# Altium schematic sheet WaterLevelControl-v1.0_top.SchDoc
size A4; SheetNumber: 1; SheetTotal: 5
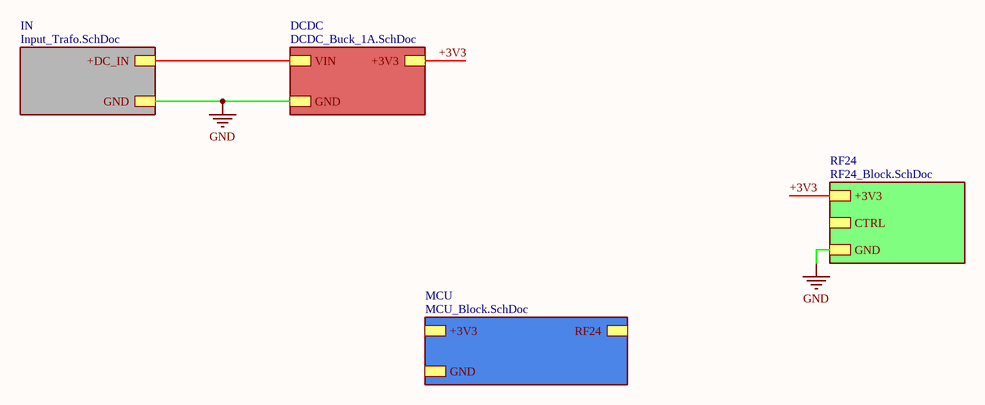
[diagram p0: WaterLevelControl-v1.0_top.SchDoc]

## Sub-sheets
DCDC = DCDC_Buck_1A.SchDoc: GND, VIN, +3V3
IN = Input_Trafo.SchDoc: +DC_IN, GND
MCU = MCU_Block.SchDoc: RF24 (harness RF24), +3V3, GND
RF24 = RF24_Block.SchDoc: +3V3, GND, CTRL (harness RF24)

## Nets
GND: sheet IN/GND, sheet DCDC/GND, sheet RF24/GND
+3V3: sheet DCDC/+3V3, sheet RF24/+3V3
(unnamed): sheet IN/+DC_IN, sheet DCDC/VIN